# Altium project Keyboard.PrjPCB
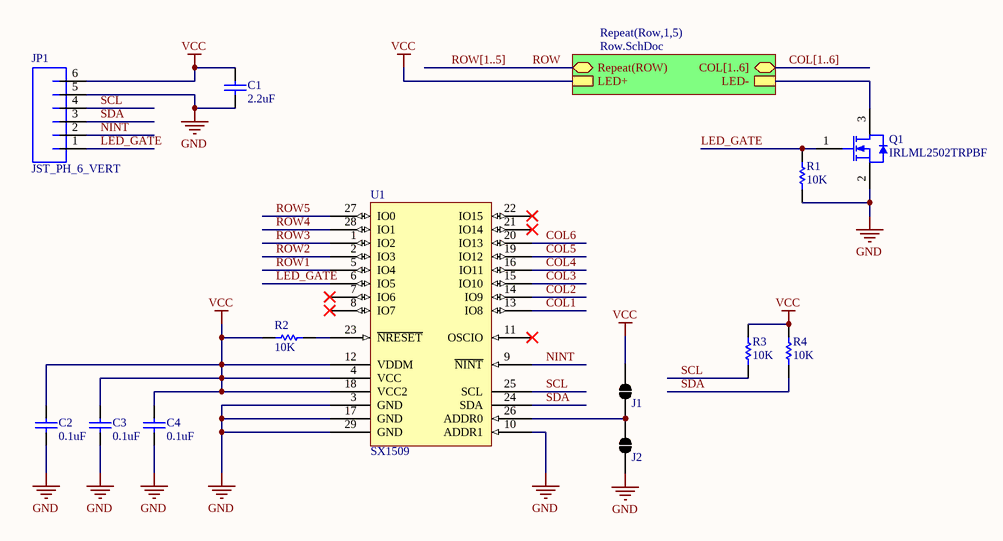
[diagram p0: Keyboard.SchDoc]
3 sheets, 43 parts. Net scope: hierarchical (ports join the sheet entries above them; power ports are global).
Board file: Keyboard.PcbDoc
Sheets:
  Keyboard.SchDoc
    Row1 = Row.SchDoc
      Switch1 = Switch.SchDoc
      Switch2 = Switch.SchDoc
      Switch3 = Switch.SchDoc
      Switch4 = Switch.SchDoc
      Switch5 = Switch.SchDoc
      Switch6 = Switch.SchDoc
    Row2 = Row.SchDoc
      Switch1 = Switch.SchDoc
      Switch2 = Switch.SchDoc
      Switch3 = Switch.SchDoc
      Switch4 = Switch.SchDoc
      Switch5 = Switch.SchDoc
      Switch6 = Switch.SchDoc
    Row3 = Row.SchDoc
      Switch1 = Switch.SchDoc
      Switch2 = Switch.SchDoc
      Switch3 = Switch.SchDoc
      Switch4 = Switch.SchDoc
      Switch5 = Switch.SchDoc
      Switch6 = Switch.SchDoc
    Row4 = Row.SchDoc
      Switch1 = Switch.SchDoc
      Switch2 = Switch.SchDoc
      Switch3 = Switch.SchDoc
      Switch4 = Switch.SchDoc
      Switch5 = Switch.SchDoc
      Switch6 = Switch.SchDoc
    Row5 = Row.SchDoc
      Switch1 = Switch.SchDoc
      Switch2 = Switch.SchDoc
      Switch3 = Switch.SchDoc
      Switch4 = Switch.SchDoc
      Switch5 = Switch.SchDoc
      Switch6 = Switch.SchDoc

## Sheet Keyboard.SchDoc
size A

### Parts
C1  2.2uF  [CAPC0603(1608)100_N]
C2  0.1uF  [CAPC0603(1608)100_N]
C3  0.1uF  [CAPC0603(1608)100_N]
C4  0.1uF  [CAPC0603(1608)100_N]
J1  ADDR_H  [SOLDER JUMPER]  (value not drawn)
J2  ADDR_L  [SOLDER JUMPER]  (value not drawn)
JP1  JST_PH_6_VERT  [JST_PH_6_MIRRORABLE]
Q1  IRLML2502TRPBF  [INTR-SOT-23-3_V]
R1  10K  [RESC0603(1608)_N]
R2  10K  [RESC0603(1608)_N]
R3  10K  [RESC0603(1608)_N]
R4  10K  [RESC0603(1608)_N]
U1  SX1509  [QFN_UT_28]

### Sub-sheets
Repeat(Row,1,5) = Row.SchDoc: COL[1..6] (bidir), Repeat(ROW) (bidir), LED+, LED-

### Nets
GND: C1.2 C2.1 C3.1 C4.1 J2.1 JP1.5 Q1.2(S) R1.1 U1.3(GND) U1.10(ADDR1) U1.17(GND) U1.29(GND)
VCC: C1.1 C2.2 C3.2 C4.2 J1.2 JP1.6 R2.2 R3.1 R4.1 U1.4(VCC) U1.12(VDDM) U1.18(VCC2) ; sheet Repeat(Row,1,5)/LED+
COL1: U1.13(IO8)
COL2: U1.14(IO9)
COL3: U1.15(IO10)
COL4: U1.16(IO11)
COL5: U1.19(IO12)
COL6: U1.20(IO13)
LED_GATE: JP1.1 Q1.1(G) R1.2 U1.6(IO5)
NINT: JP1.2 U1.9(~{NINT})
ROW: sheet Repeat(Row,1,5)/Repeat(ROW)
ROW1: U1.5(IO4)
ROW2: U1.2(IO3)
ROW3: U1.1(IO2)
ROW4: U1.28(IO1)
ROW5: U1.27(IO0)
SCL: JP1.4 R3.2 U1.25(SCL)
SDA: JP1.3 R4.2 U1.24(SDA)
NetJ1_1: J1.1 J2.2 U1.26(ADDR0)
NetQ1_3: Q1.3(D) ; sheet Repeat(Row,1,5)/LED-
NetR2_1: R2.1 U1.23(~{NRESET})

Not connected (* = marked no-connect by the designer): U1 7(IO6)* 8(IO7)* 11(OSCIO)* 21(IO14)* 22(IO15)*

### Buses and harness runs
bus COL[1..6] = sheet Repeat(Row,1,5)/COL[1..6]
bus ROW[1..5]

### Library data of the parts
C1 = CMP-1035-02767-1: CAP 2.2uF 25V ±10% 0603 (1608 Metric) Thickness 1mm SMD; Case-EIA: 0603; Tolerance: Â±10%; Case-Metric: 1608; Technology: SMT; Value: 2.2uF; Max Thickness: 1 mm; Rated Voltage: 25 V
C2-C4 = CMP-1035-02595-1: CAP 100nF 100V ±10% 0603 (1608 Metric) Thickness 1mm SMD; Tolerance: Â±10%; Case-EIA: 0603; Case-Metric: 1608; Rated Voltage: 100 V; Value: 100nF; Technology: SMT; Max Thickness: 1 mm
J1 J2 = Solder Jumper
JP1 = JST_PH_6_VERT: PartNumber: B6B-PH-K-S(LF)(SN); Manufacturer: JST Sales America Inc.; PackageReference: JST-PH; Mounting Technology: Through Hole
Q1 = CMP-2000-04985-1: N-Channel HEXFET(R) Power MOSFET, 20 V VDS, +/- 12 V VGS, 4.2 A, 3-Pin SOT23, RoHS, Tape and Reel; Manufacturer: International Rectifier; Drain-to-Source Voltage [Vdss]: 20V; Drain-Source On Resistance-Max: 0.045O; Qg Gate Charge: 8nC; Rated Power Dissipation: 1.25W; Package Reference: SOT-23-3; Manufacturer URL: http://internationalrectifier.com/; Package Description: 3-Pin Small Outline Transistor, Body 2.92 x 1.3 mm, Pitch 0.95 mm; Datasheet Version: Apr-14; Channel Type: N-Channel; Datasheet URL: https://datasheet.ciiva.com/6383/irlml2502pbf-6383216.pdf
R1-R4 = CMP-1012-00098-1: 10K 0.1W 5% 0603 (1608 Metric)  SMD; Case-EIA: 0603; Value: 10000.00 Ohm; Case-Metric: 1608; Technology: SMT; Tolerance: 5 %; Power: 0.1 W
U1 = SX1509: Supplier 1: Mouser; Supplier 2: Digi-Key; Supplier 3: Digi-Key; Supplier Part Number 1: 947-SX1509BIULTRT; Supplier Part Number 2: SX1509BIULDKR-ND; Supplier Part Number 3: SX1509BIULCT-ND

## Sheet Row.SchDoc
size A
Used 5 times, as channels Row1, Row2, Row3, Row4, Row5. Parts and nets are listed once, with the designators drawn on the sheet.
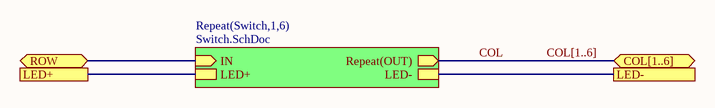
[diagram p1: Row.SchDoc]

### Sub-sheets
Repeat(Switch,1,6) = Switch.SchDoc: Repeat(OUT) (out), IN (in), LED-, LED+

### Ports
COL[1..6] (bidir), LED+, LED-, ROW (bidir)

### Nets
COL: sheet Repeat(Switch,1,6)/Repeat(OUT)
LED+: port LED+, sheet Repeat(Switch,1,6)/LED+
LED-: port LED-, sheet Repeat(Switch,1,6)/LED-
ROW: port ROW, sheet Repeat(Switch,1,6)/IN

### Channels
Row1: ports LED+=VCC LED-=NetQ1_3 ROW=ROW1
Row2: ports LED+=VCC LED-=NetQ1_3 ROW=ROW2
Row3: ports LED+=VCC LED-=NetQ1_3 ROW=ROW3
Row4: ports LED+=VCC LED-=NetQ1_3 ROW=ROW4
Row5: ports LED+=VCC LED-=NetQ1_3 ROW=ROW5

### Buses and harness runs
bus COL[1..6] = port COL[1..6]

## Sheet Switch.SchDoc
size A
Used 30 times, as channels Row1/Switch1, Row1/Switch2, Row1/Switch3, Row1/Switch4, Row1/Switch5, Row1/Switch6, Row2/Switch1, Row2/Switch2, Row2/Switch3, Row2/Switch4, Row2/Switch5, Row2/Switch6, Row3/Switch1, Row3/Switch2, Row3/Switch3, Row3/Switch4, Row3/Switch5, Row3/Switch6, Row4/Switch1, Row4/Switch2, Row4/Switch3, Row4/Switch4, Row4/Switch5, Row4/Switch6, Row5/Switch1, Row5/Switch2, Row5/Switch3, Row5/Switch4, Row5/Switch5, Row5/Switch6. Parts and nets are listed once, with the designators drawn on the sheet.
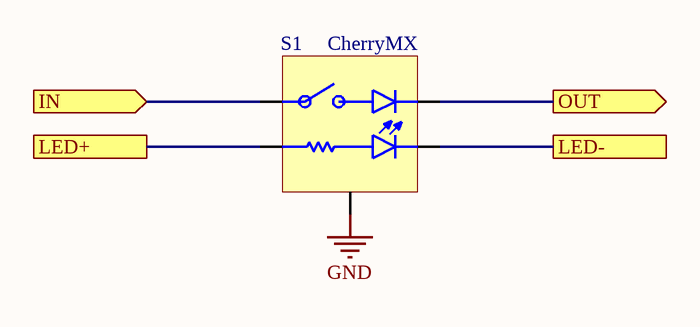
[diagram p2: Switch.SchDoc]

### Parts
S1  CherryMX  [CherryMX_Mirrorable]

### Ports
IN (in), LED+, LED-, OUT (out)

### Nets
GND: S1.1(GND)
IN: S1.2 ; port IN
LED+: S1.4 ; port LED+
LED-: S1.5 ; port LED-
OUT: S1.3 ; port OUT

### Channels
Row1/Switch1: designators end in _1; ports IN=ROW1 LED+=VCC LED-=NetQ1_3 OUT=COL1
Row1/Switch2: designators end in _2; ports IN=ROW1 LED+=VCC LED-=NetQ1_3 OUT=COL2
Row1/Switch3: designators end in _3; ports IN=ROW1 LED+=VCC LED-=NetQ1_3 OUT=COL3
Row1/Switch4: designators end in _4; ports IN=ROW1 LED+=VCC LED-=NetQ1_3 OUT=COL4
Row1/Switch5: designators end in _5; ports IN=ROW1 LED+=VCC LED-=NetQ1_3 OUT=COL5
Row1/Switch6: designators end in _6; ports IN=ROW1 LED+=VCC LED-=NetQ1_3 OUT=COL6
Row2/Switch1: designators end in _7; ports IN=ROW2 LED+=VCC LED-=NetQ1_3 OUT=COL1
Row2/Switch2: designators end in _8; ports IN=ROW2 LED+=VCC LED-=NetQ1_3 OUT=COL2
Row2/Switch3: designators end in _9; ports IN=ROW2 LED+=VCC LED-=NetQ1_3 OUT=COL3
Row2/Switch4: designators end in _10; ports IN=ROW2 LED+=VCC LED-=NetQ1_3 OUT=COL4
Row2/Switch5: designators end in _11; ports IN=ROW2 LED+=VCC LED-=NetQ1_3 OUT=COL5
Row2/Switch6: designators end in _12; ports IN=ROW2 LED+=VCC LED-=NetQ1_3 OUT=COL6
Row3/Switch1: designators end in _13; ports IN=ROW3 LED+=VCC LED-=NetQ1_3 OUT=COL1
Row3/Switch2: designators end in _14; ports IN=ROW3 LED+=VCC LED-=NetQ1_3 OUT=COL2
Row3/Switch3: designators end in _15; ports IN=ROW3 LED+=VCC LED-=NetQ1_3 OUT=COL3
Row3/Switch4: designators end in _16; ports IN=ROW3 LED+=VCC LED-=NetQ1_3 OUT=COL4
Row3/Switch5: designators end in _17; ports IN=ROW3 LED+=VCC LED-=NetQ1_3 OUT=COL5
Row3/Switch6: designators end in _18; ports IN=ROW3 LED+=VCC LED-=NetQ1_3 OUT=COL6
Row4/Switch1: designators end in _19; ports IN=ROW4 LED+=VCC LED-=NetQ1_3 OUT=COL1
Row4/Switch2: designators end in _20; ports IN=ROW4 LED+=VCC LED-=NetQ1_3 OUT=COL2
Row4/Switch3: designators end in _21; ports IN=ROW4 LED+=VCC LED-=NetQ1_3 OUT=COL3
Row4/Switch4: designators end in _22; ports IN=ROW4 LED+=VCC LED-=NetQ1_3 OUT=COL4
Row4/Switch5: designators end in _23; ports IN=ROW4 LED+=VCC LED-=NetQ1_3 OUT=COL5
Row4/Switch6: designators end in _24; ports IN=ROW4 LED+=VCC LED-=NetQ1_3 OUT=COL6
Row5/Switch1: designators end in _25; ports IN=ROW5 LED+=VCC LED-=NetQ1_3 OUT=COL1
Row5/Switch2: designators end in _26; ports IN=ROW5 LED+=VCC LED-=NetQ1_3 OUT=COL2
Row5/Switch3: designators end in _27; ports IN=ROW5 LED+=VCC LED-=NetQ1_3 OUT=COL3
Row5/Switch4: designators end in _28; ports IN=ROW5 LED+=VCC LED-=NetQ1_3 OUT=COL4
Row5/Switch5: designators end in _29; ports IN=ROW5 LED+=VCC LED-=NetQ1_3 OUT=COL5
Row5/Switch6: designators end in _30; ports IN=ROW5 LED+=VCC LED-=NetQ1_3 OUT=COL6

## Nets that join several sheets
GND: Keyboard (12 pins), Row1/Switch1 (S1_1.1), Row1/Switch2 (S1_2.1), Row1/Switch3 (S1_3.1), Row1/Switch4 (S1_4.1), Row1/Switch5 (S1_5.1), Row1/Switch6 (S1_6.1), Row2/Switch1 (S1_7.1), Row2/Switch2 (S1_8.1), Row2/Switch3 (S1_9.1), Row2/Switch4 (S1_10.1), Row2/Switch5 (S1_11.1), Row2/Switch6 (S1_12.1), Row3/Switch1 (S1_13.1), Row3/Switch2 (S1_14.1), Row3/Switch3 (S1_15.1), Row3/Switch4 (S1_16.1), Row3/Switch5 (S1_17.1), Row3/Switch6 (S1_18.1), Row4/Switch1 (S1_19.1), Row4/Switch2 (S1_20.1), Row4/Switch3 (S1_21.1), Row4/Switch4 (S1_22.1), Row4/Switch5 (S1_23.1), Row4/Switch6 (S1_24.1), Row5/Switch1 (S1_25.1), Row5/Switch2 (S1_26.1), Row5/Switch3 (S1_27.1), Row5/Switch4 (S1_28.1), Row5/Switch5 (S1_29.1), Row5/Switch6 (S1_30.1)
VCC: Keyboard (12 pins), Row1/Switch1 (S1_1.4), Row1/Switch2 (S1_2.4), Row1/Switch3 (S1_3.4), Row1/Switch4 (S1_4.4), Row1/Switch5 (S1_5.4), Row1/Switch6 (S1_6.4), Row2/Switch1 (S1_7.4), Row2/Switch2 (S1_8.4), Row2/Switch3 (S1_9.4), Row2/Switch4 (S1_10.4), Row2/Switch5 (S1_11.4), Row2/Switch6 (S1_12.4), Row3/Switch1 (S1_13.4), Row3/Switch2 (S1_14.4), Row3/Switch3 (S1_15.4), Row3/Switch4 (S1_16.4), Row3/Switch5 (S1_17.4), Row3/Switch6 (S1_18.4), Row4/Switch1 (S1_19.4), Row4/Switch2 (S1_20.4), Row4/Switch3 (S1_21.4), Row4/Switch4 (S1_22.4), Row4/Switch5 (S1_23.4), Row4/Switch6 (S1_24.4), Row5/Switch1 (S1_25.4), Row5/Switch2 (S1_26.4), Row5/Switch3 (S1_27.4), Row5/Switch4 (S1_28.4), Row5/Switch5 (S1_29.4), Row5/Switch6 (S1_30.4)
COL1: Keyboard (U1.13), Row1/Switch1 (S1_1.3), Row2/Switch1 (S1_7.3), Row3/Switch1 (S1_13.3), Row4/Switch1 (S1_19.3), Row5/Switch1 (S1_25.3)
COL2: Keyboard (U1.14), Row1/Switch2 (S1_2.3), Row2/Switch2 (S1_8.3), Row3/Switch2 (S1_14.3), Row4/Switch2 (S1_20.3), Row5/Switch2 (S1_26.3)
COL3: Keyboard (U1.15), Row1/Switch3 (S1_3.3), Row2/Switch3 (S1_9.3), Row3/Switch3 (S1_15.3), Row4/Switch3 (S1_21.3), Row5/Switch3 (S1_27.3)
COL4: Keyboard (U1.16), Row1/Switch4 (S1_4.3), Row2/Switch4 (S1_10.3), Row3/Switch4 (S1_16.3), Row4/Switch4 (S1_22.3), Row5/Switch4 (S1_28.3)
COL5: Keyboard (U1.19), Row1/Switch5 (S1_5.3), Row2/Switch5 (S1_11.3), Row3/Switch5 (S1_17.3), Row4/Switch5 (S1_23.3), Row5/Switch5 (S1_29.3)
COL6: Keyboard (U1.20), Row1/Switch6 (S1_6.3), Row2/Switch6 (S1_12.3), Row3/Switch6 (S1_18.3), Row4/Switch6 (S1_24.3), Row5/Switch6 (S1_30.3)
NetQ1_3: Keyboard (Q1.3), Row1/Switch1 (S1_1.5), Row1/Switch2 (S1_2.5), Row1/Switch3 (S1_3.5), Row1/Switch4 (S1_4.5), Row1/Switch5 (S1_5.5), Row1/Switch6 (S1_6.5), Row2/Switch1 (S1_7.5), Row2/Switch2 (S1_8.5), Row2/Switch3 (S1_9.5), Row2/Switch4 (S1_10.5), Row2/Switch5 (S1_11.5), Row2/Switch6 (S1_12.5), Row3/Switch1 (S1_13.5), Row3/Switch2 (S1_14.5), Row3/Switch3 (S1_15.5), Row3/Switch4 (S1_16.5), Row3/Switch5 (S1_17.5), Row3/Switch6 (S1_18.5), Row4/Switch1 (S1_19.5), Row4/Switch2 (S1_20.5), Row4/Switch3 (S1_21.5), Row4/Switch4 (S1_22.5), Row4/Switch5 (S1_23.5), Row4/Switch6 (S1_24.5), Row5/Switch1 (S1_25.5), Row5/Switch2 (S1_26.5), Row5/Switch3 (S1_27.5), Row5/Switch4 (S1_28.5), Row5/Switch5 (S1_29.5), Row5/Switch6 (S1_30.5)
ROW1: Keyboard (U1.5), Row1/Switch1 (S1_1.2), Row1/Switch2 (S1_2.2), Row1/Switch3 (S1_3.2), Row1/Switch4 (S1_4.2), Row1/Switch5 (S1_5.2), Row1/Switch6 (S1_6.2)
ROW2: Keyboard (U1.2), Row2/Switch1 (S1_7.2), Row2/Switch2 (S1_8.2), Row2/Switch3 (S1_9.2), Row2/Switch4 (S1_10.2), Row2/Switch5 (S1_11.2), Row2/Switch6 (S1_12.2)
ROW3: Keyboard (U1.1), Row3/Switch1 (S1_13.2), Row3/Switch2 (S1_14.2), Row3/Switch3 (S1_15.2), Row3/Switch4 (S1_16.2), Row3/Switch5 (S1_17.2), Row3/Switch6 (S1_18.2)
ROW4: Keyboard (U1.28), Row4/Switch1 (S1_19.2), Row4/Switch2 (S1_20.2), Row4/Switch3 (S1_21.2), Row4/Switch4 (S1_22.2), Row4/Switch5 (S1_23.2), Row4/Switch6 (S1_24.2)
ROW5: Keyboard (U1.27), Row5/Switch1 (S1_25.2), Row5/Switch2 (S1_26.2), Row5/Switch3 (S1_27.2), Row5/Switch4 (S1_28.2), Row5/Switch5 (S1_29.2), Row5/Switch6 (S1_30.2)